# Altium project Top.PrjPCB
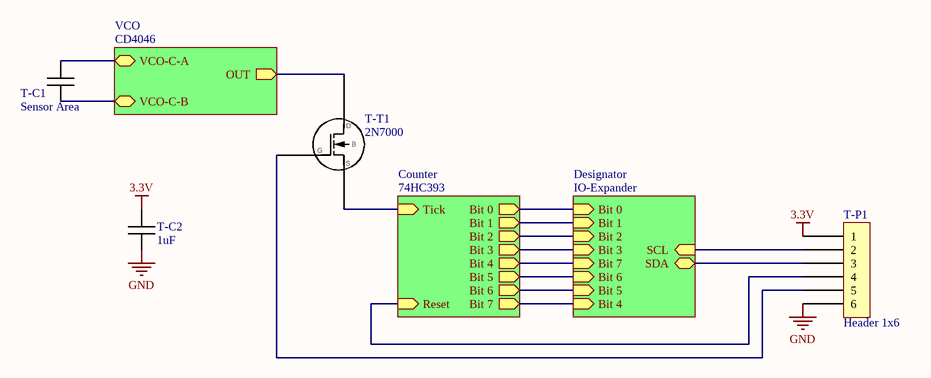
[diagram p0: Top.SchDoc]
3 sheets, 7 parts. Net scope: hierarchical (ports join the sheet entries above them; power ports are global).
Board file: PCB.PcbDoc
Sheets:
  Top.SchDoc
    CD4046 = VCO.SchDoc
    74HC393 = Counter.SchDoc

## Sheet Top.SchDoc
size A4

### Parts
T-C1  Sensor Area
T-C2  1uF  [C 0805 / 2012]
T-P1  Header 1x6  [Header 1x6]
T-T1  2N7000  [SOT-23-3]

### Sub-sheets
74HC393 = Counter: Tick (in), Reset (in), Bit 0 (out), Bit 1 (out), Bit 2 (out), Bit 3 (out), Bit 4 (out), Bit 5 (out), Bit 6 (out), Bit 7 (out)
CD4046 = VCO: VCO-C-A (bidir), VCO-C-B (bidir), OUT (out)
Designator = IO-Expander (file not in this document): Bit 0 (in), Bit 1 (in), Bit 2 (in), Bit 3 (in), Bit 4 (in), Bit 5 (in), Bit 6 (in), Bit 7 (in), SCL (in), SDA (bidir)

### Nets
3.3V: T-C2.1 T-P1.1
GND: T-C2.2 T-P1.6
NetT-C1_1: T-C1.1 ; sheet CD4046/VCO-C-A
NetT-C1_2: T-C1.2 ; sheet CD4046/VCO-C-B
NetT-P1_2: T-P1.2 ; sheet Designator/SCL
NetT-P1_3: T-P1.3 ; sheet Designator/SDA
NetT-P1_4: T-P1.4 ; sheet 74HC393/Reset
NetT-P1_5: T-P1.5 T-T1.1
NetT-T1_2: T-T1.2 ; sheet 74HC393/Tick
NetT-T1_3: T-T1.3 ; sheet CD4046/OUT
(unnamed): sheet 74HC393/Bit 0, sheet Designator/Bit 0
(unnamed): sheet 74HC393/Bit 1, sheet Designator/Bit 1
(unnamed): sheet 74HC393/Bit 2, sheet Designator/Bit 2
(unnamed): sheet 74HC393/Bit 3, sheet Designator/Bit 3
(unnamed): sheet 74HC393/Bit 4, sheet Designator/Bit 7
(unnamed): sheet 74HC393/Bit 5, sheet Designator/Bit 6
(unnamed): sheet 74HC393/Bit 6, sheet Designator/Bit 5
(unnamed): sheet 74HC393/Bit 7, sheet Designator/Bit 4

### Library data of the parts
T-C1 T-C2 = Capacitor
T-T1 = 2N7000: N-FET

## Sheet VCO.SchDoc
size A4
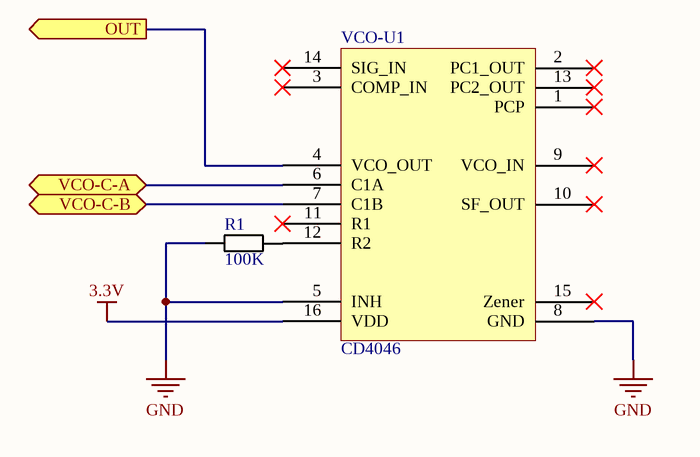
[diagram p1: VCO.SchDoc]

### Parts
R1  100K  [R 0805 / 2012]
VCO-U1  CD4046  [SOIC-16]

### Ports
OUT (out), VCO-C-A (bidir), VCO-C-B (bidir)

### Nets
3.3V: VCO-U1.16(VDD)
GND: R1.2 VCO-U1.5(INH) VCO-U1.8(GND)
NetR1_1: R1.1 VCO-U1.12(R2)
NetT-C1_1: VCO-U1.6(C1A) ; port VCO-C-A
NetT-C1_2: VCO-U1.7(C1B) ; port VCO-C-B
NetT-T1_3: VCO-U1.4(VCO_OUT) ; port OUT

Not connected (* = marked no-connect by the designer): VCO-U1 1(PCP)* 2(PC1_OUT)* 3(COMP_IN)* 9(VCO_IN)* 10(SF_OUT)* 11(R1)* 13(PC2_OUT)* 14(SIG_IN)* 15(Zener)*

### Library data of the parts
R1 = Resistor
VCO-U1 = CD4046: PLL / VCO

## Sheet Counter.SchDoc
size A4
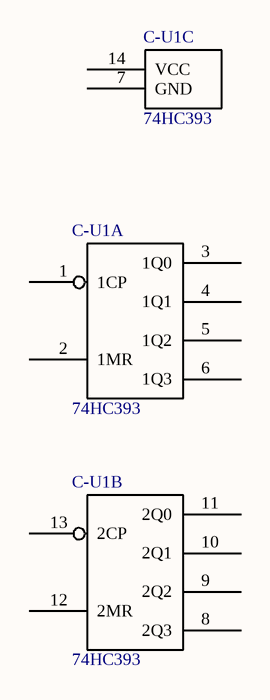
[diagram p2: Counter.SchDoc]

### Parts
C-U1  74HC393  [SOIC-14]  (parts A,B,C of 3)

### Nets

Not connected (* = marked no-connect by the designer): C-U1 1(1CP) 2(1MR) 3(1Q0) 4(1Q1) 5(1Q2) 6(1Q3) 7(GND) 8(2Q3) 9(2Q2) 10(2Q1) 11(2Q0) 12(2MR) 13(2CP) 14(VCC)

### Library data of the parts
C-U1 = 74HC393: Dual 4-Bit Counter

## Nets that join several sheets
3.3V: Top (T-C2.1 T-P1.1), VCO (VCO-U1.16)
GND: Top (T-C2.2 T-P1.6), VCO (R1.2 VCO-U1.5 VCO-U1.8)
NetT-C1_1: Top (T-C1.1), VCO (VCO-U1.6)
NetT-C1_2: Top (T-C1.2), VCO (VCO-U1.7)
NetT-T1_3: Top (T-T1.3), VCO (VCO-U1.4)